# Altium schematic sheet ModemUartLevelTranslator.SchDoc
size A4; Organization: Altium Limited; Address1: L3, 12a Rodborough Rd; Address2: Frenchs Forest; Address3: NSW; Address4: Australia 2086
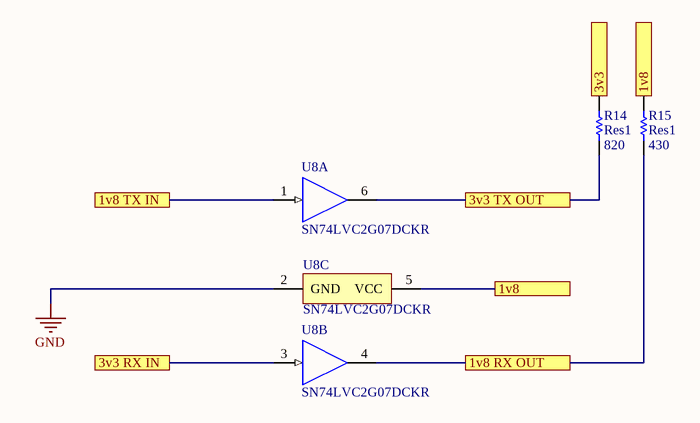
[diagram p0: ModemUartLevelTranslator.SchDoc]

## Parts
R14  Res1  value 820  [AXIAL-0.3]
R15  Res1  value 430  [AXIAL-0.3]
U8  SN74LVC2G07DCKR  [DCK0006A_N]  (parts A,B,C of 3)

## Ports
1v8, 1v8 RX OUT, 1v8 TX IN, 3v3, 3v3 RX IN, 3v3 TX OUT

## Nets
GND: U8.2(GND)
1v8: R15.2 U8.5(VCC) ; port 1v8
1v8 RX OUT: R15.1 U8.4(2Y) ; port 1v8 RX OUT
1v8 TX IN: U8.1(1A) ; port 1v8 TX IN
3v3: R14.2 ; port 3v3
3v3 RX IN: U8.3(2A) ; port 3v3 RX IN
3v3 TX OUT: R14.1 U8.6(1Y) ; port 3v3 TX OUT

## Notes on the sheet
- Title
- Size:
- Date:
- A4
- Number:
- Time:
- Revision:
- Sheet
- of
- File:

## Library data of the parts
R14 R15 = Res1: Resistor; Published: 8-Jun-2000; LatestRevisionDate: 17-Jul-2002; LatestRevisionNote: Re-released for DXP Platform.; PackageReference: AXIAL-0.3; Publisher: Altium Limited; PackageDescription: Axial Device, Thru-Hole; 2 Leads; 0.3 in Pin Spacing
U8 = SN74LVC2G07DCKR: Dual Buffer/Driver with Open-Drain Output, DCK0006A, LARGE T&R; Manufacturer: Texas Instruments; VCC(Min)(V): 1.65; VCC(Max)(V): 5.5; Output Type: CMOS; ICC @ Nom Voltage(Max)(mA): 0.01; Input Type: CMOS/TTL; Bits(#): 2; F @ Nom Voltage(Max)(Mhz): 150; Rating: Catalog; Technology Family: LVC; Voltage(Nom)(V): 1.8,2.5,3.3,5; Schmitt Trigger: No; Output Drive (IOL/IOH)(Max)(mA): 32/-32; tpd @ Nom Voltage(Max)(ns): 8.6,4.4,3.7,2.9; Logic: True; Sub-Family: Inverting Buffer/Driver; DatasheetVersion: SCES308K; PackageReference: DCK0006A; Supplier 1: Mouser; Supplier Part Number 1: 595-SN74LVC2G07DCKR; Supplier 2: Digi-Key; Supplier Part Number 2: 296-13495-2-ND; Supplier 3: Digi-Key; Supplier Part Number 3: 296-13495-1-ND; Supplier 4: Digi-Key; Supplier Part Number 4: 296-13495-6-ND; Generic Part Number: SN74LVC2G07; Operating Temperature Range(C): -40 to 125; 3-State Output: No; PartNumber: SN74LVC2G07DCKR; ComponentLink1Description: Manufacturer URL; ComponentLink1URL: http://www.ti.com/; ComponentLink2Description: Datasheet; ComponentLink2URL: http://www.ti.com/lit/ds/symlink/sn74lvc2g07.pdf